# Altium schematic sheet Sheet1.SchDoc
size A; SheetNumber: 1; SheetTotal: 1
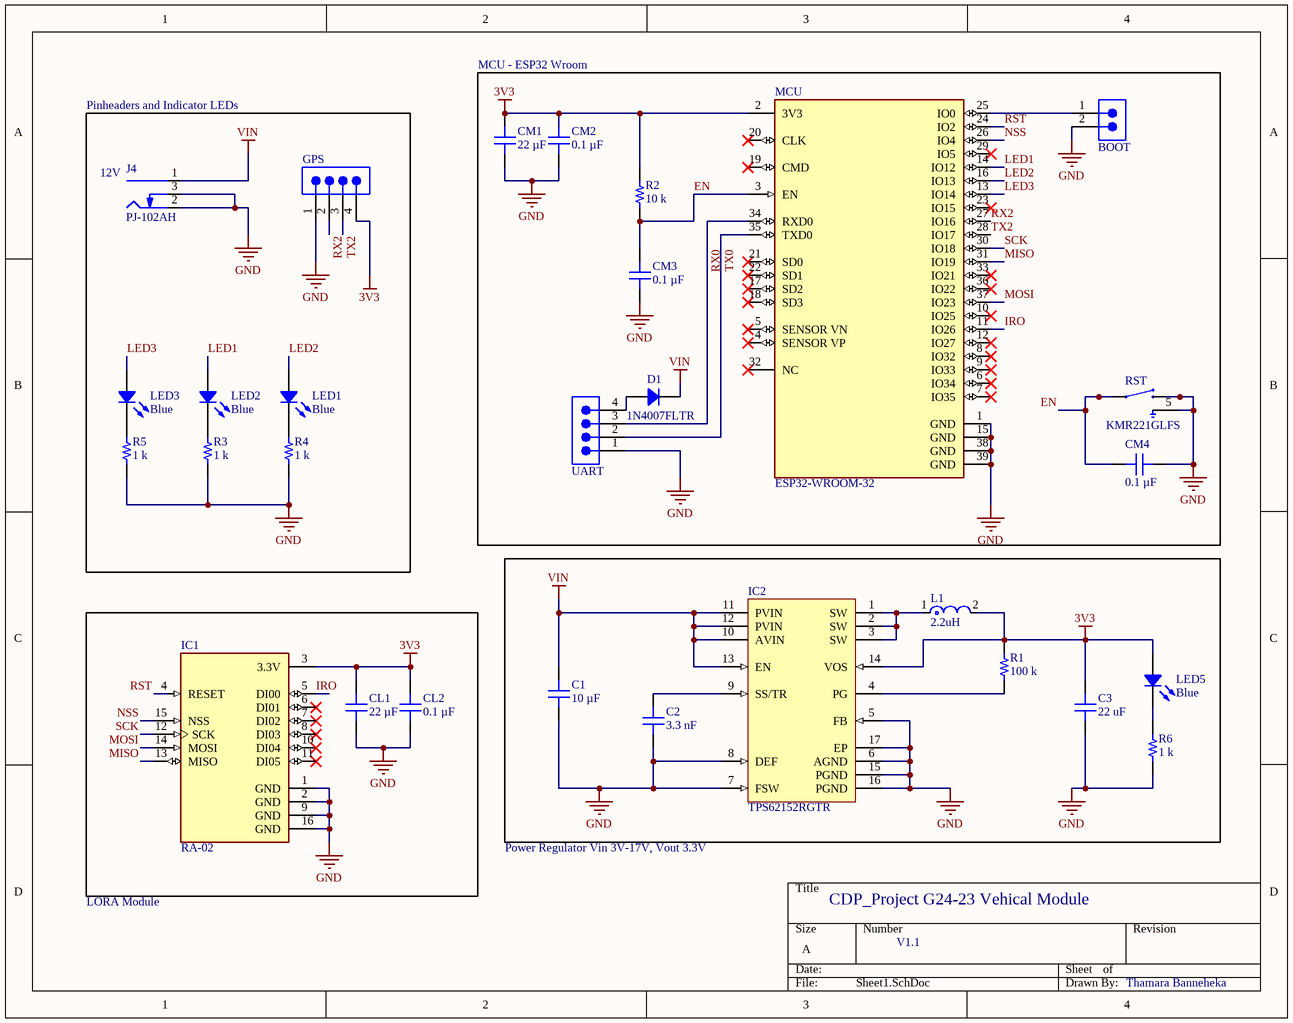
[diagram p0: Sheet1.SchDoc]

## Parts
BOOT  CMP-011-000133-1  [61300211121]  (value not drawn)
C1  10 µF  [CAP 0805_2012]
C2  Capacitance: 3.3 nF  [CAP 0805_2012]  (hidden comment: 3300 pF)
C3  Capacitance: 22 uF  [CAP 0805_2012]  (hidden comment: 0.022 µF)
CL1  22 µF  [CAP 0805_2012]
CL2  0.1 µF  [CAP 0805_2012]
CM1  22 µF  [CAP 0805_2012]
CM2  0.1 µF  [CAP 0805_2012]
CM3  0.1 µF  [CAP 0805_2012]
CM4  0.1 µF  [CAP 0805_2012]
D1  1N4007FLTR  [SOD123F]
GPS  CMP-011-000141-1  [61300411121]  (value not drawn)
IC1  RA-02  [RA-02]
IC2  TPS62152RGTR  [RGT0016C_V]
J4  PJ-102AH  [CUI PJ-102AH]
L1  2.2uH  [FP-XFL4020-MFG]
LED1  Blue  [LED 0603_1608 BLUE]
LED2  Blue  [LED 0603_1608 BLUE]
LED3  Blue  [LED 0603_1608 BLUE]
LED5  Blue  [LED 0603_1608 BLUE]
MCU  ESP32-WROOM-32  [FP-ESP32-WROOM-32-MFG]
R1  100 k  [RES 0805_2012]
R2  10 k  [RES 0805_2012]
R3  1 k  [RES 0805_2012]
R4  1 k  [RES 0805_2012]
R5  1 k  [RES 0805_2012]
R6  1 k  [RES 0805_2012]
RST  KMR221GLFS  [SW_KMR221GLFS]
UART  CMP-011-000141-1  [61300411121]  (value not drawn)

## Blocks framed on the sheet
MCU - ESP32 Wroom: BOOT CM1-CM4 D1 MCU R2 RST UART

## Nets
3V3: C3.2 CL1.2 CL2.2 CM1.2 CM2.2 GPS.4 IC1.3(3.3V) IC2.14(VOS) L1.2 LED5.1 MCU.2(3V3) R1.2 R2.2
GND: BOOT.2 C1.1 C2.1 C3.1 CL1.1 CL2.1 CM1.1 CM2.1 CM3.1 CM4.1 GPS.1 IC1.1(GND) IC1.2(GND) IC1.9(GND) IC1.16(GND) IC2.5(FB) IC2.6(AGND) IC2.7(FSW) IC2.8(DEF) IC2.15(PGND) IC2.16(PGND) IC2.17(EP) J4.2(Outer) J4.3(SW) MCU.1(GND) MCU.15(GND) MCU.38(GND) MCU.39(GND) R3.1 R4.1 R5.1 R6.1 RST.2 RST.3 RST.5 UART.1
VIN: C1.2 D1.2 IC2.10(AVIN) IC2.11(PVIN) IC2.12(PVIN) IC2.13(EN) J4.1(Centre)
EN: CM3.2 CM4.2 MCU.3(EN) R2.1 RST.1 RST.4
IRO: IC1.5(DI00) MCU.11(IO26)
LED1: LED2.1 MCU.14(IO12)
LED2: LED1.1 MCU.16(IO13)
LED3: LED3.1 MCU.13(IO14)
MISO: IC1.13(MISO) MCU.31(IO19)
MOSI: IC1.14(MOSI) MCU.37(IO23)
NSS: IC1.15(NSS) MCU.26(IO4)
RST: IC1.4(RESET) MCU.24(IO2)
RX0: MCU.34(RXD0) UART.3
RX2: GPS.2 MCU.27(IO16)
SCK: IC1.12(SCK) MCU.30(IO18)
TX0: MCU.35(TXD0) UART.2
TX2: GPS.3 MCU.28(IO17)
NetBOOT_1: BOOT.1 MCU.25(IO0)
NetC2_2: C2.2 IC2.9(SS/TR)
NetD1_1: D1.1 UART.4
NetIC2_1: IC2.1(SW) IC2.2(SW) IC2.3(SW) L1.1
NetIC2_4: IC2.4(PG) R1.1
NetLED1_2: LED1.2 R4.2
NetLED2_2: LED2.2 R3.2
NetLED3_2: LED3.2 R5.2
NetLED5_2: LED5.2 R6.2

Not connected (* = marked no-connect by the designer): IC1 6(DI01)* 7(DI02)* 8(DI03)* 10(DI04)* 11(DI05)*; MCU 4(SENSOR_VP)* 5(SENSOR_VN)* 6(IO34)* 7(IO35)* 8(IO32)* 9(IO33)* 10(IO25)* 12(IO27)* 17(SD2)* 18(SD3)* 19(CMD)* 20(CLK)* 21(SD0)* 22(SD1)* 23(IO15)* 29(IO5)* 32(NC)* 33(IO21)* 36(IO22)*

## Notes on the sheet
- Pinheaders and Indicator LEDs
- (near J4) 12V
- LORA Module
- Power Regulator Vin 3V-17V, Vout 3.3V
- CDP_Project G24-23 Vehical Module
- V1.1
- Thamara Banneheka

## Library data of the parts
BOOT = CMP-011-000133-1: WR-PHD Pin Header, THT, Vertical, pitch 2.54mm, 1 Row, 2P; Manufacturer: Wurth Elektronik; Contact Resistance: 20mOhm; Rated Current: 3A; Working Voltage: 250V; Withstanding Voltage: 500V; Manufacturer Part Number: 61300211121; Category: Board-to-Board Connectors; Match Code: WR-PHD; ComponentLink1Description: Website Link; ComponentLink1URL: https://www.we-online.com/redexpert/article/61300211121?ad; ComponentLink2Description: Datasheet Link; ComponentLink2URL: https://www.we-online.com/redexpert/spec/61300211121?ad; Mount: Through Hole; Operating Temperature Max: 105°C; Operating Temperature Min: -40°C; Packaging: Bag; Gender: Pin Header; Number of Pins: 2; Number of Rows: 1; Orientation: Vertical; Pitch: 2.54mm; Source: WR-PHD.SchLib; Pin Count: 2; Design Item ID: 61300211121; Component Type: Standard
C1 = C2012X6S1C106K125AC: CAP CER 10UF 16V X6S 0805; manufacturer: TDK Corporation; Tolerance: ±10%; Part Number: C2012X6S1C106K125AC; Capacitance: 10 µF; Applications: General Purpose; componentlink1description: Datasheet; componentlink1url: https://product.tdk.com/info/en/catalog/datasheets/mlcc_commercial_general_en.pdf?ref_disty=digikey; componentlink2description: DigiKey Link; componentlink2url: https://www.digikey.com/en/products/detail/tdk-corporation/C2012X6S1C106K125AC/2733046; Device Package: 0805 (2012 Metric); Features: Low ESL; lastupdated: 2/9/2024 8:16:08 PM; Lifecycle Status: Active; Minimum Order: 1; Mounting Type: Surface Mount, MLCC; Operating Temperature: -55°C ~ 105°C; Package / Case: 0805 (2012 Metric); packaging: TapeAndReel; partid: 2995; Part Status: Active; price: 0.06; series: C; Size / Dimension: 0.079" L x 0.049" W (2.00mm x 1.25mm); Supplier 1: DigiKey; Supplier Part Number 1: 445-7611-1-ND; Temperature Coefficient: X6S; Thickness (Max): 0.057" (1.45mm); value: 10 µF; Voltage - Rated: 16V
C2 = C0805C332F5GECAUTO: CAP CER 0805 3.3NF 50V C0G 1%; manufacturer: KEMET; Temperature Coefficient: C0G, NP0; Part Number: C0805C332F5GECAUTO; Applications: Automotive, ESD Protection; componentlink1description: Datasheet; componentlink1url: https://api.kemet.com/component-edge/download/datasheet/C0805C332F5GECAUTO.pdf; componentlink2description: DigiKey Link; componentlink2url: https://www.digikey.com/en/products/detail/kemet/C0805C332F5GECAUTO/8647273; Device Package: 0805 (2012 Metric); Features: Low ESL; lastupdated: 2/9/2024 8:15:00 PM; Lifecycle Status: Active; Minimum Order: 1; Mounting Type: Surface Mount, MLCC; Operating Temperature: -55°C ~ 125°C; Package / Case: 0805 (2012 Metric); packaging: TapeAndReel; partid: 41544; Part Status: Active; price: 0.27; Ratings: AEC-Q200; series: ESD SMD Auto C0G; Size / Dimension: 0.079" L x 0.049" W (2.00mm x 1.25mm); Supplier 1: DigiKey; Supplier Part Number 1: 399-C0805C332F5GECAUTOCT-ND; Thickness (Max): 0.035" (0.88mm); Tolerance: ±1%; value: 3300 pF; Voltage - Rated: 50V
C3 = C0805C223K5RECAUTO: CAP CER 0805 22NF 50V X7R 10%; manufacturer: KEMET; Part Number: C0805C223K5RECAUTO; Applications: Automotive, ESD Protection; componentlink1description: Datasheet; componentlink1url: https://api.kemet.com/component-edge/download/datasheet/C0805C223K5RECAUTO.pdf; componentlink2description: DigiKey Link; componentlink2url: https://www.digikey.com/en/products/detail/kemet/C0805C223K5RECAUTO/8640480; Device Package: 0805 (2012 Metric); lastupdated: 2/9/2024 8:15:30 PM; Lifecycle Status: Active; Minimum Order: 1; Mounting Type: Surface Mount, MLCC; Operating Temperature: -55°C ~ 125°C; Package / Case: 0805 (2012 Metric); packaging: TapeAndReel; partid: 15719; Part Status: Active; price: 0.04; Ratings: AEC-Q200; series: ESD SMD Auto X7R; Size / Dimension: 0.079" L x 0.049" W (2.00mm x 1.25mm); Supplier 1: DigiKey; Supplier Part Number 1: 399-17886-1-ND; Temperature Coefficient: X7R; Thickness (Max): 0.035" (0.88mm); Tolerance: ±10%; value: 0.022 µF; Voltage - Rated: 50V
CL1 CM1 = CL21A226KOQNNNG: CAP CER 22UF 16V X5R 0805; manufacturer: Samsung Electro-Mechanics; Tolerance: ±10%; Part Number: CL21A226KOQNNNG; Capacitance: 22 µF; Applications: General Purpose; componentlink1description: Datasheet; componentlink1url: //media.digikey.com/pdf/Data%20Sheets/Samsung%20PDFs/CL21A226KOQNNNG_Spec.pdf; componentlink2description: DigiKey Link; componentlink2url: https://www.digikey.com/en/products/detail/samsung-electro-mechanics/CL21A226KOQNNNG/3894433; Device Package: 0805 (2012 Metric); lastupdated: 2/9/2024 8:16:07 PM; Lifecycle Status: Active; Minimum Order: 1; Mounting Type: Surface Mount, MLCC; Operating Temperature: -55°C ~ 85°C; Package / Case: 0805 (2012 Metric); packaging: TapeAndReel; partid: 3000; Part Status: Active; price: 0.06; series: CL; Size / Dimension: 0.079" L x 0.049" W (2.00mm x 1.25mm); Supplier 1: DigiKey; Supplier Part Number 1: 1276-7092-1-ND; Temperature Coefficient: X5R; Thickness (Max): 0.055" (1.40mm); value: 22 µF; Voltage - Rated: 16V
CL2 CM2-CM4 = CC0805MRX7R9BB104: CAP CER 0.1UF 50V X7R 0805; manufacturer: Yageo; Tolerance: ±20%; Part Number: CC0805MRX7R9BB104; Capacitance: 0.1 µF; Applications: General Purpose; componentlink1description: Datasheet; componentlink1url: https://www.yageo.com/upload/media/product/productsearch/datasheet/mlcc/UPY-GPHC_X7R_6.3V-to-50V_18.pdf; componentlink2description: DigiKey Link; componentlink2url: https://www.digikey.com/en/products/detail/yageo/CC0805MRX7R9BB104/5884281; Device Package: 0805 (2012 Metric); lastupdated: 2/9/2024 8:16:09 PM; Lifecycle Status: Active; Minimum Order: 1; Mounting Type: Surface Mount, MLCC; Operating Temperature: -55°C ~ 125°C; Package / Case: 0805 (2012 Metric); packaging: TapeAndReel; partid: 2475; Part Status: Active; price: 0.01; series: CC; Size / Dimension: 0.079" L x 0.049" W (2.00mm x 1.25mm); Supplier 1: DigiKey; Supplier Part Number 1: 311-4351-1-ND; Temperature Coefficient: X7R; Thickness (Max): 0.037" (0.95mm); value: 0.1 µF; Voltage - Rated: 50V
D1 = 1N4007FLTR: STANDARD RECTIFIER 1000V SOD-123; Manufacturer: SMC Diode Solutions; Capacitance @ Vr, F: 15pF @ 4V, 1MHz; Current - Average Rectified (Io): 1A; Current - Reverse Leakage @ Vr: 5µA @ 1000V; Speed: Standard Recovery >500ns, > 200mA (Io); Voltage - Forward (Vf) (Max) @ If: 1.1V @ 1A; Part Number: 1N4007FLTR; ComponentLink1Description: Datasheet; ComponentLink1URL: http://www.smc-diodes.com/propdf/1N4001FL-1N4007FL%20N1646%20REV.A.pdf; ComponentLink2Description: DigiKey Link; ComponentLink2URL: http://digikey.com/product-detail/en/smc-diode-solutions/1N4007FLTR/1655-1N4007FLCT-ND/11657827; Diode Type: Standard; LastUpdated: 8/30/2020 8:59:55 PM; Lifecycle Status: Active; Minimum Order: 1; Mounting Type: Surface Mount; Package / Case: SOD-123F; Packaging: TapeAndReel; PartId: 3314; Price: 0.01; Supplier 1: DigiKey; Supplier Part Number 1: 1655-1N4007FLCT-ND; Supplier Device Package: SOD-123FL; Voltage - DC Reverse (Vr) (Max): 1000V
GPS UART = CMP-011-000141-1: WR-PHD Pin Header, THT, Vertical, pitch 2.54mm, 1 Row, 4P; Manufacturer: Wurth Elektronik; Contact Resistance: 20mOhm; Rated Current: 3A; Working Voltage: 250V; Withstanding Voltage: 500V; Manufacturer Part Number: 61300411121; Category: Board-to-Board Connectors; Match Code: WR-PHD; ComponentLink1Description: Website Link; ComponentLink1URL: https://www.we-online.com/redexpert/article/61300411121?ad; ComponentLink2Description: Datasheet Link; ComponentLink2URL: https://www.we-online.com/redexpert/spec/61300411121?ad; Mount: Through Hole; Operating Temperature Max: 105°C; Operating Temperature Min: -40°C; Packaging: Bag; Gender: Pin Header; Number of Pins: 4; Number of Rows: 1; Orientation: Vertical; Pitch: 2.54mm; Source: WR-PHD.SchLib; Component Type: Standard; Design Item ID: 61300411121; Pin Count: 4
IC1 = CMP-006-000001-1: General ISM < 1GHz LoRaâ„¢ Transceiver Module 410MHz ~ 525MHz Antenna Not Included, I-PEX Surface Mount; MF: Ai-Thinker; Price: None; Package: None; Pin Count: 16; Design Item ID: RA-02; Component Type: Standard; SnapEDA_Link: https://www.snapeda.com/parts/RA-02/AI-Thinker/view-part/?ref=snap; MP: RA-02; Source: RA-02.SchLib; Check_prices: https://www.snapeda.com/parts/RA-02/AI-Thinker/view-part/?ref=eda; Availability: Not in stock; Value: *
IC2 = CMP-0323-00110-3: Buck Step Down Regulator with 3 to 17 V Input and 3.3 V Output, -40 to 85 degC, 16-Pin QFN (RGT), Green (RoHS & no Sb/Br); Manufacturer: Texas Instruments; Rating: Catalog; Synchronous Rectification: TRUE; Vout(Min)(V): 3.3; SubFamily: Step-Down Regulator; Vin(Min)(V): 3; Vin(Max)(V): 17; Regulated Outputs(#): 1; Switch Current Limit(Typ)(A): 1.7; Duty Cycle(Max)(%): 100; Iq(Typ)(mA): 0.017; Eco-Plan: Green (RoHS & no Sb/Br); PackageDescription: 16-Pin Plastic Quad Flat No-Lead, 3 x 3 mm Body, 0.5 mm Pitch, 1.7 x 1.7 mm Exposed Pad; Mounting Technology: Surface Mount; ComponentLink2Description: Package Specification; ComponentLink3URL: Samples URL:http://www.ti.com/product/tps62152#samples; DatasheetVersion: SLVSAL5; PartNumber: TPS62152RGTR; Code_JEDEC: MO-220; Preset Vout(V): 3.3; ComponentLink1Description: Datasheet; Topology: Buck; Vout(Max)(V): 3.3; PackageVersion: revH, Oct-2011; ComponentLink1URL: http://www.ti.com/general/docs/lit/getliterature.tsp?genericPartNumber=TPS62152&fileType=pdf; ComponentLink2URL: http://www.ti.com/litv/pdf/mpqf119g; ComponentLink3Description: URL Link1; PackageReference: RGT0016C; Iout(Max)(A): 1
J4 = PJ-102AH: CONN PWR JACK 2X5.5MM SOLDER; Manufacturer: CUI Devices; Actual Diameter: 0.079" (2.00mm ID), 0.256" (6.50mm OD); Current Rating (Amps): 5A; Gender: Male; Industry Recognized Mating Diameter: 2.00mm ID (0.079"), 5.50mm OD (0.217"); Internal Switch(s): Single Switch, Normally Closed; Material Flammability Rating: UL94 V-0; Mating Length/Depth: 0.354" (9.00mm); Number of Positions/Contacts: 2 Conductors, 3 Contacts; Shielding: Unshielded; Voltage - Rated: 24VDC; Part Number: PJ-102AH; ComponentLink1Description: Datasheet; ComponentLink1URL: https://www.cuidevices.com/product/resource/digikeypdf/pj-102ah.pdf; ComponentLink2Description: DigiKey Link; ComponentLink2URL: //digikey.com/product-detail/en/cui-devices/PJ-102AH/CP-102AH-ND/408448; Connector Type: Jack; LastUpdated: 12/16/2019 7:01:27 PM; Lifecycle Status: 0; Minimum Order: 1; Mounting Type: Through Hole, Right Angle; Packaging: Tray; Part Status: Active; Price: 0.76; Series: -; Supplier 1: DigiKey; Supplier Part Number 1: CP-102AH-ND; Termination: Solder
L1 = CMP-2000-05090-4: INDUCTOR, 2.2UH, 8A, 20%, 38MHZ, REEL; Test Frequency: 100kHz; Shielding: Shielded; Saturation Current: 3.1A; DC Resistance (DCR): 23.5mR; Core Material: Composite; Height: 2.1mm; Width: 4.3mm; Mount: Surface Mount; RMS Current (Irms): 8A; Case/Package: SMD/SMT; Length: 4.3mm; REACH SVHC: No SVHC; Max DC Current: 8A; Min Operating Temperature: -40°C; Series: XFL4020; Self Resonant Frequency: 38MHz; Inductance Tolerance: 20%; Lead Free: Contains Lead; Tolerance: 20%; RoHS Compliant: Yes; Termination: SMD/SMT; Packaging: Tape and Reel; Max Operating Temperature: 125°C; Inductance: 2.2uH
LED1-LED3 = SM0603UBWC: LED BLUE CLEAR 0603 SMD; Manufacturer: Bivar Inc.; Configuration: Standard; Current - Test: 20mA; Lens Color: Colorless; Lens Size: 1.00mm x 0.80mm; Lens Style: Rectangle with Flat Top; Millicandela Rating: 115mcd; Viewing Angle: 130°; Voltage - Forward (Vf) (Typ): 3V; Wavelength - Dominant: 470nm; Wavelength - Peak: 468nm; Part Number: SM0603UBWC; Color: Blue; ComponentLink1Description: Datasheet; ComponentLink1URL: https://www.bivar.com/Files/Datasheets/SM0603UBWC.pdf; ComponentLink2Description: DigiKey Link; ComponentLink2URL: https://www.digikey.com/en/products/detail/bivar-inc/SM0603UBWC/2408546; Device Package: 0603 (1608 Metric); Height (Max): 0.80mm; LastUpdated: 6/3/2024 7:57:52 PM; Lens Transparency: Clear; Lifecycle Status: Active; Minimum Order: 1; Mounting Type: Surface Mount; Package / Case: 0603 (1608 Metric); Packaging: TapeAndReel; PartId: 807; Part Status: Active; Price: 0.46; Series: -; Size / Dimension: 1.60mm L x 0.80mm W; Supplier 1: DigiKey; Supplier Part Number 1: 492-1327-1-ND; Supplier Device Package: 0603; Value: Blue
LED5 = LSM0603463V: LED BLUE CLEAR CHIP 0603 SMD; Manufacturer: Visual Communications Company - VCC; Configuration: Standard; Current - Test: 20mA; Lens Color: Colorless; Lens Size: 1.20mm x 0.80mm; Lens Style: Rectangle with Flat Top; Millicandela Rating: 20mcd; Viewing Angle: 120°; Voltage - Forward (Vf) (Typ): 3V; Wavelength - Dominant: 469nm; Part Number: LSM0603463V; Color: Blue; ComponentLink1Description: Datasheet; ComponentLink1URL: https://vcclite.com/wp-content/uploads/wpallimport/files/files/LSM0603463V.pdf; ComponentLink2Description: DigiKey Link; ComponentLink2URL: https://www.digikey.com/en/products/detail/visual-communications-company-vcc/LSM0603463V/9486725; Device Package: 0603 (1608 Metric); Height (Max): 0.50mm; LastUpdated: 6/3/2024 7:57:52 PM; Lens Transparency: Clear; Lifecycle Status: Active; Minimum Order: 1; Mounting Type: Surface Mount; Package / Case: 0603 (1608 Metric); Packaging: TapeAndReel; PartId: 781; Part Status: Active; Price: 0.12; Series: LSM0603; Size / Dimension: 1.60mm L x 0.80mm W; Supplier 1: DigiKey; Supplier Part Number 1: LSM0603463VCT-ND; Supplier Device Package: Chip LED; Value: Blue; Wavelength - Peak: 469nm
MCU = CMP-194065-000008-1: RX TXRX MOD WIFI SURFACE MOUNT; Frequency: 2.5GHz; Sensitivity: -98dBm; Operating Supply Voltage: 3.6V; Data Rate: 150Mbps; Weight: 0.088185oz; Package Quantity: 550; Min Operating Temperature: -40°C; Mount: Surface Mount; Max Operating Temperature: 85°C; Packaging: Cut Tape; Case/Package: SMD/SMT
R1 R2 = RCS0805100KFKEA: RES SMD 100K OHM 1% 1/2W 0805; Manufacturer: Vishay Dale; Power (Watts): 0.5W, 1/2W; Resistance: 100 kOhms; Temperature Coefficient: ±100ppm/°C; Part Number: RCS0805100KFKEA; ComponentLink1Description: Datasheet; ComponentLink1URL: http://www.vishay.com/docs/20065/rcse3.pdf; ComponentLink2Description: DigiKey Link; ComponentLink2URL: https://www.digikey.com/en/products/detail/vishay-dale/RCS0805100KFKEA/5866996; Composition: Thick Film; Device Package: 0805 (2012 Metric); Features: Automotive AEC-Q200, Pulse Withstanding; Height - Seated (Max): 0.020" (0.50mm); LastUpdated: 2/8/2024 9:02:38 PM; Lifecycle Status: Active; Minimum Order: 1; Number of Terminations: 2; Operating Temperature: -55°C ~ 155°C; Package / Case: 0805 (2012 Metric); Packaging: TapeAndReel; PartId: 27789; Part Status: Active; Price: 0.02; Ratings: AEC-Q200; Series: RCS e3; Size / Dimension: 0.079" L x 0.049" W (2.00mm x 1.25mm); Supplier 1: DigiKey; Supplier Part Number 1: 541-2850-1-ND; Supplier Device Package: 0805; Tolerance: ±1%
  R1: Value: 100 k
  R2: Value: 10 k
R3-R6 = RCS0805100KFKEA: RES SMD 100K OHM 1% 1/2W 0805; Manufacturer: Vishay Dale; Power (Watts): 0.5W, 1/2W; Resistance: 1 kOhms; Temperature Coefficient: ±100ppm/°C; Part Number: RCS0805100KFKEA; Value: 1 k; ComponentLink1Description: Datasheet; ComponentLink1URL: http://www.vishay.com/docs/20065/rcse3.pdf; ComponentLink2Description: DigiKey Link; ComponentLink2URL: https://www.digikey.com/en/products/detail/vishay-dale/RCS0805100KFKEA/5866996; Composition: Thick Film; Device Package: 0805 (2012 Metric); Features: Automotive AEC-Q200, Pulse Withstanding; Height - Seated (Max): 0.020" (0.50mm); LastUpdated: 2/8/2024 9:02:38 PM; Lifecycle Status: Active; Minimum Order: 1; Number of Terminations: 2; Operating Temperature: -55°C ~ 155°C; Package / Case: 0805 (2012 Metric); Packaging: TapeAndReel; PartId: 27789; Part Status: Active; Price: 0.02; Ratings: AEC-Q200; Series: RCS e3; Size / Dimension: 0.079" L x 0.049" W (2.00mm x 1.25mm); Supplier 1: DigiKey; Supplier Part Number 1: 541-2850-1-ND; Supplier Device Package: 0805; Tolerance: ±1%
RST = CMP-009-000003-1: Switch Tactile N.O. SPST Button Gull Wing 0.05A 32VDC 1VA 200000Cycles 2N SMD Automotive T/R; Source: KMR221GLFS.SchLib; Value: *; Package: None; Price: None; MP: KMR221GLFS; Availability: Unavailable; Pin Count: 5; Component Type: Standard; Design Item ID: KMR221GLFS